# Altium project IEEE SmartLamp Project.PrjPcb
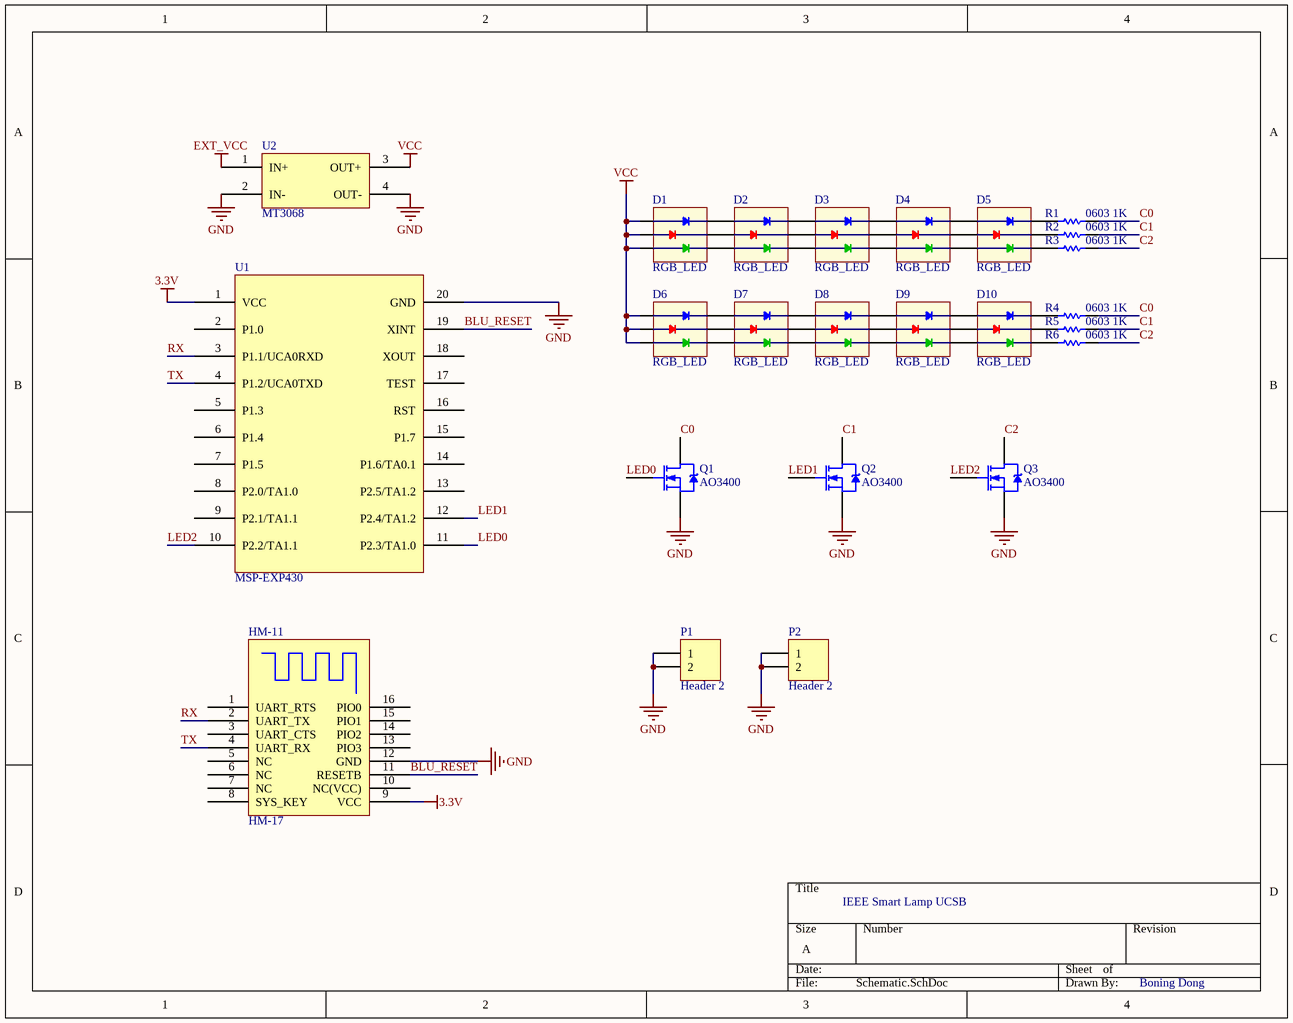
[diagram p0: Schematic.SchDoc]
1 sheet, 24 parts. Net scope: global (net labels, ports and power ports of the same name join across sheets).
Board file: PCB.PcbDoc

## Sheet Schematic.SchDoc
size A

### Parts
D1  RGB_LED  [LED5050]
D2  RGB_LED  [LED5050]
D3  RGB_LED  [LED5050]
D4  RGB_LED  [LED5050]
D5  RGB_LED  [LED5050]
D6  RGB_LED  [LED5050]
D7  RGB_LED  [LED5050]
D8  RGB_LED  [LED5050]
D9  RGB_LED  [LED5050]
D10  RGB_LED  [LED5050]
HM-11  HM-17  [HM_05_06_07_11_13_17]
P1  Header 2  [HDR1X2]
P2  Header 2  [HDR1X2]
Q1  AO3400  [SOT23]
Q2  AO3400  [SOT23]
Q3  AO3400  [SOT23]
R1  0603  value 1K  [D0603]
R2  0603  value 1K  [D0603]
R3  0603  value 1K  [D0603]
R4  0603  value 1K  [D0603]
R5  0603  value 1K  [D0603]
R6  0603  value 1K  [D0603]
U1  MSP-EXP430  [MSP-EXP430]
U2  MT3068  [MT3068-usb]

### Nets
3.3V: HM-11.9(VCC) U1.1(VCC)
EXT_VCC: U2.1(IN+)
GND: HM-11.12(GND) P1.1 P1.2 P2.1 P2.2 Q1.3(S) Q2.3(S) Q3.3(S) U1.20(GND) U2.2(IN-) U2.4(OUT-)
VCC: D1.1(R+) D1.2(G+) D1.3(B+) D6.1(R+) D6.2(G+) D6.3(B+) U2.3(OUT+)
BLU_RESET: HM-11.11(RESETB) U1.19(XINT)
C0: Q1.2(D) R1.2 R4.2
C1: Q2.2(D) R2.2 R5.2
C2: Q3.2(D) R3.2 R6.2
LED0: Q1.1(G) U1.11(P2.3/TA1.0)
LED1: Q2.1(G) U1.12(P2.4/TA1.2)
LED2: Q3.1(G) U1.10(P2.2/TA1.1)
RX: HM-11.2(UART_TX) U1.3(P1.1/UCA0RXD)
TX: HM-11.4(UART_RX) U1.4(P1.2/UCA0TXD)
NetD1_4: D1.4(B-) D2.3(B+)
NetD1_5: D1.5(G-) D2.2(G+)
NetD1_6: D1.6(R-) D2.1(R+)
NetD2_4: D2.4(B-) D3.3(B+)
NetD2_5: D2.5(G-) D3.2(G+)
NetD2_6: D2.6(R-) D3.1(R+)
NetD3_4: D3.4(B-) D4.3(B+)
NetD3_5: D3.5(G-) D4.2(G+)
NetD3_6: D3.6(R-) D4.1(R+)
NetD4_4: D4.4(B-) D5.3(B+)
NetD4_5: D4.5(G-) D5.2(G+)
NetD4_6: D4.6(R-) D5.1(R+)
NetD5_4: D5.4(B-) R3.1
NetD5_5: D5.5(G-) R2.1
NetD5_6: D5.6(R-) R1.1
NetD6_4: D6.4(B-) D7.3(B+)
NetD6_5: D6.5(G-) D7.2(G+)
NetD6_6: D6.6(R-) D7.1(R+)
NetD7_4: D7.4(B-) D8.3(B+)
NetD7_5: D7.5(G-) D8.2(G+)
NetD7_6: D7.6(R-) D8.1(R+)
NetD8_4: D8.4(B-) D9.3(B+)
NetD8_5: D8.5(G-) D9.2(G+)
NetD8_6: D8.6(R-) D9.1(R+)
NetD9_4: D9.4(B-) D10.3(B+)
NetD9_5: D9.5(G-) D10.2(G+)
NetD9_6: D9.6(R-) D10.1(R+)
NetD10_4: D10.4(B-) R6.1
NetD10_5: D10.5(G-) R5.1
NetD10_6: D10.6(R-) R4.1

Not connected (* = marked no-connect by the designer): HM-11 1(UART_RTS) 3(UART_CTS) 5(NC) 6(NC) 7(NC) 8(SYS_KEY) 10(NC(VCC)) 13(PIO3) 14(PIO2) 15(PIO1) 16(PIO0); U1 2(P1.0) 5(P1.3) 6(P1.4) 7(P1.5) 8(P2.0/TA1.0) 9(P2.1/TA1.1) 13(P2.5/TA1.2) 14(P1.6/TA0.1) 15(P1.7) 16(RST) 17(TEST) 18(XOUT)

### Notes on the sheet
- IEEE Smart Lamp UCSB
- Boning Dong

### Library data of the parts
P1 P2 = Header 2: Header, 2-Pin; LatestRevisionDate: 17-Jul-2002; LatestRevisionNote: Re-released for DXP Platform.; Publisher: Altium Limited
Q1-Q3 = NMOS: N-Channel Power MOSFET; Note: Pin 2 is electrically connected to pin 4.; Published: 8-Jun-2000; LatestRevisionDate: 17-Jul-2002; LatestRevisionNote: Re-released for DXP Platform.; DatasheetVersion: PD-9.814; PackageVersion: Feb-1997; PackageReference: TO-220AB; Publisher: Altium Limited; PackageDescription: TO, Thru-Hole, Vertical, Heatsink Mounted; 3 In-Line Leads; Pitch 2.54 mm; ComponentLink1Description: Manufacturer Link; ComponentLink1URL: http://www.irf.com/
R1-R6 = Res1: Resistor; Published: 8-Jun-2000; LatestRevisionDate: 17-Jul-2002; LatestRevisionNote: Re-released for DXP Platform.; PackageReference: AXIAL-0.3; Publisher: Altium Limited; PackageDescription: Axial Device, Thru-Hole; 2 Leads; 0.3 in Pin Spacing
U1 = MSP-EXP430: MSP-EXP430 Connectors
U2 = MT3068-USB: MT3068 Boost converter with micro USB